# EAGLE design EEZ DIB PREL6 r1B3 (EAGLE 7.2.0)
Assembly variants: Farnell, TME

## Sheet 1 of 2: DIB interface
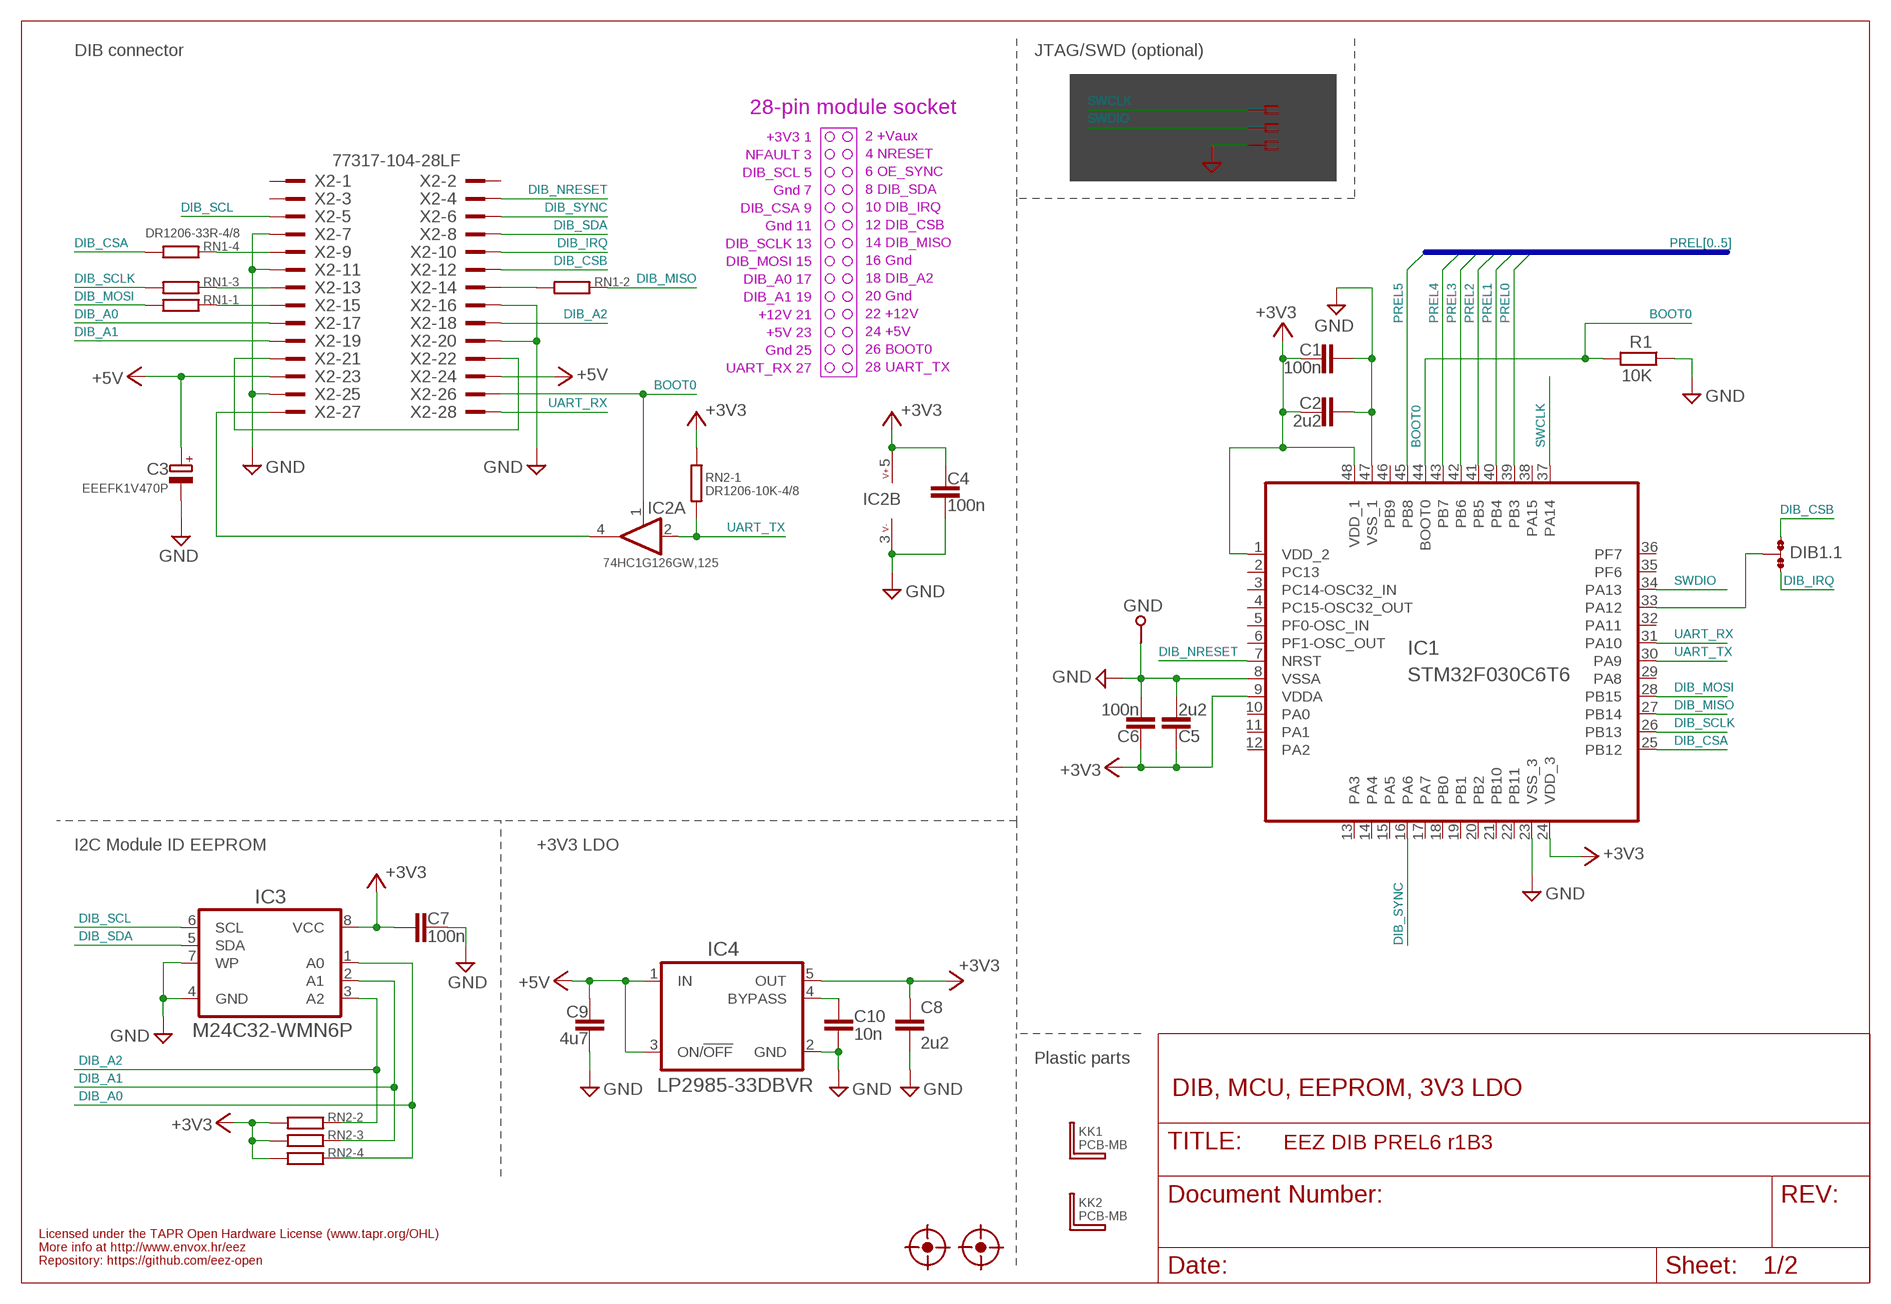
[diagram p0: schematic, sheet 1]

### Parts
C1  100n  C-EUC0603  [C0603]
C2  2u2  C-EUC0805  [C0805]
C3  EEEFK1V470P  ECAPPANASONIC_H  [CAPAE660X610N]
C4  100n  C-EUC0603  [C0603]
C5  2u2  C-EUC0805  [C0805]
C6  100n  C-EUC0603  [C0603]
C7  100n  C-EUC0603  [C0603]
C8  2u2  C-EUC0805  [C0805]
C9  4u7  C-EUC0805  [C0805]
C10  10n  C-EUC0805  [C0805]
DIB1.1  JP3-CUT-0805-ROTATED  [JP3-0805-CUT2]
FM1  FIDUCIAL_2  [FIDUCIAL_DUAL]
FM2  FIDUCIAL_2  [FIDUCIAL_DUAL]
GND  PCB_TEST_TABSHIELD  [PCB_SHIELD_TAB]
IC1  STM32F030C6T6  [LQFP-48]
IC2  74HC1G126GW,125  [SOT65P210X110-5N]
IC3  M24C32-WMN6P  AT24CXXSOIC8  [SOIC127P600X173-8N]
IC4  LP2985-33DBVR  LP2985  [SOT95P270X145-5N]
KK1  PCB-MB  [PCB-MB]
KK2  PCB-MB  [PCB-MB]
R1  10K  R-EU_R0805  [R0805]
RN1  DR1206-33R-4/8  R_ARRAY4  [CAY16]
RN2  DR1206-10K-4/8  R_ARRAY4  [CAY16]
X1  N.C.  SSW-106-02-S-S  [SSW-106-02-S-S]
X2  77317-104-28LF  [77317-104-28LF]

### Nets
+3V3: C1.2 C2.1 C4.1 C5.2 C6.1 C7.2 C8.1 IC1.1(VDD_2) IC1.9(VDDA) IC1.24(VDD_3) IC1.48(VDD_1) IC2.5(B:V+) IC3.8(VCC) IC4.5(OUT) RN2.5 RN2.6 RN2.7 RN2.8
+5V: C3.1(+) C9.2 IC4.1(IN) IC4.3(ON/!OFF) X2.23 X2.24 ; also sheet 2
BOOT0: IC1.44(BOOT0) IC2.1(A:EN) R1.2 X2.26
DIB_A0: IC3.1(A0) RN2.4 X2.17
DIB_A1: IC3.2(A1) RN2.3 X2.19
DIB_A2: IC3.3(A2) RN2.2 X2.18
DIB_CSA: IC1.25(PB12) RN1.4
DIB_CSB: DIB1.1.NO X2.12
DIB_IRQ: DIB1.1.NC X2.10
DIB_MISO: IC1.27(PB14) RN1.2
DIB_MOSI: IC1.28(PB15) RN1.1
DIB_NRESET: IC1.7(NRST) X2.4
DIB_SCL: IC3.6(SCL) X2.5
DIB_SCLK: IC1.26(PB13) RN1.3
DIB_SDA: IC3.5(SDA) X2.8
DIB_SYNC: IC1.16(PA6) X2.6
DIB_UART_RX: IC2.4(A:O) X2.27
GND: C1.1 C2.2 C3.2(-) C4.2 C5.1 C6.2 C7.1 C8.2 C9.1 C10.1 GND.1 IC1.8(VSSA) IC1.23(VSS_3) IC1.47(VSS_1) IC2.3(B:V-) IC3.4(GND) IC3.7(WP) IC4.2(GND) R1.1 X1.3 X2.7 X2.11 X2.16 X2.20 X2.25 ; also sheet 2
N$12: X2.21 X2.22
N$13: DIB1.1.COM IC1.33(PA12)
N$69: RN1.5 X2.9
N$70: C10.2 IC4.4(BYPASS)
N$99: RN1.6 X2.13
N$101: RN1.7 X2.14
N$102: RN1.8 X2.15
PREL0: IC1.39(PB3) ; also sheet 2
PREL1: IC1.40(PB4) ; also sheet 2
PREL2: IC1.41(PB5) ; also sheet 2
PREL3: IC1.42(PB6) ; also sheet 2
PREL4: IC1.43(PB7) ; also sheet 2
PREL5: IC1.45(PB8) ; also sheet 2
SWCLK: IC1.37(PA14) X1.2
SWDIO: IC1.34(PA13) X1.4
UART_RX: IC1.31(PA10) X2.28
UART_TX: IC1.30(PA9) IC2.2(A:I) RN2.1
Unconnected: IC1.2(PC13) IC1.3(PC14-OSC32_IN) IC1.4(PC15-OSC32_OUT) IC1.5(PF0-OSC_IN) IC1.6(PF1-OSC_OUT) IC1.10(PA0) IC1.11(PA1) IC1.12(PA2) IC1.13(PA3) IC1.14(PA4) IC1.15(PA5) IC1.17(PA7) IC1.18(PB0) IC1.19(PB1) IC1.20(PB2) IC1.21(PB10) IC1.22(PB11) IC1.29(PA8) IC1.32(PA11) IC1.35(PF6) IC1.36(PF7) IC1.38(PA15) IC1.46(PB9) X1.1 X1.5 X1.6 X2.1 X2.2 X2.3

### Buses
PREL[0..5]

### Notes on the sheet
- DIB connector | JTAG/SWD (optional)
- 28-pin module socket
- +3V3 1
- 2 +Vaux
- NFAULT 3
- 4 NRESET
- DIB_SCL 5
- 6 OE_SYNC
- Gnd 7
- 8 DIB_SDA
- DIB_CSA 9
- 10 DIB_IRQ
- Gnd 11
- 12 DIB_CSB
- DIB_SCLK 13
- 14 DIB_MISO
- DIB_MOSI 15
- 16 Gnd
- DIB_A0 17
- 18 DIB_A2
- DIB_A1 19
- 20 Gnd
- +12V 21
- 22 +12V
- +5V 23
- 24 +5V
- Gnd 25
- 26 BOOT0
- UART_RX 27
- 28 UART_TX
- I2C Module ID EEPROM | +3V3 LDO
- Plastic parts
- DIB, MCU, EEPROM, 3V3 LDO
- Licensed under the TAPR Open Hardware License (www.tapr.org/OHL)
- More info at http://www.envox.hr/eez
- Repository: https://github.com/eez-open

## Sheet 2 of 2
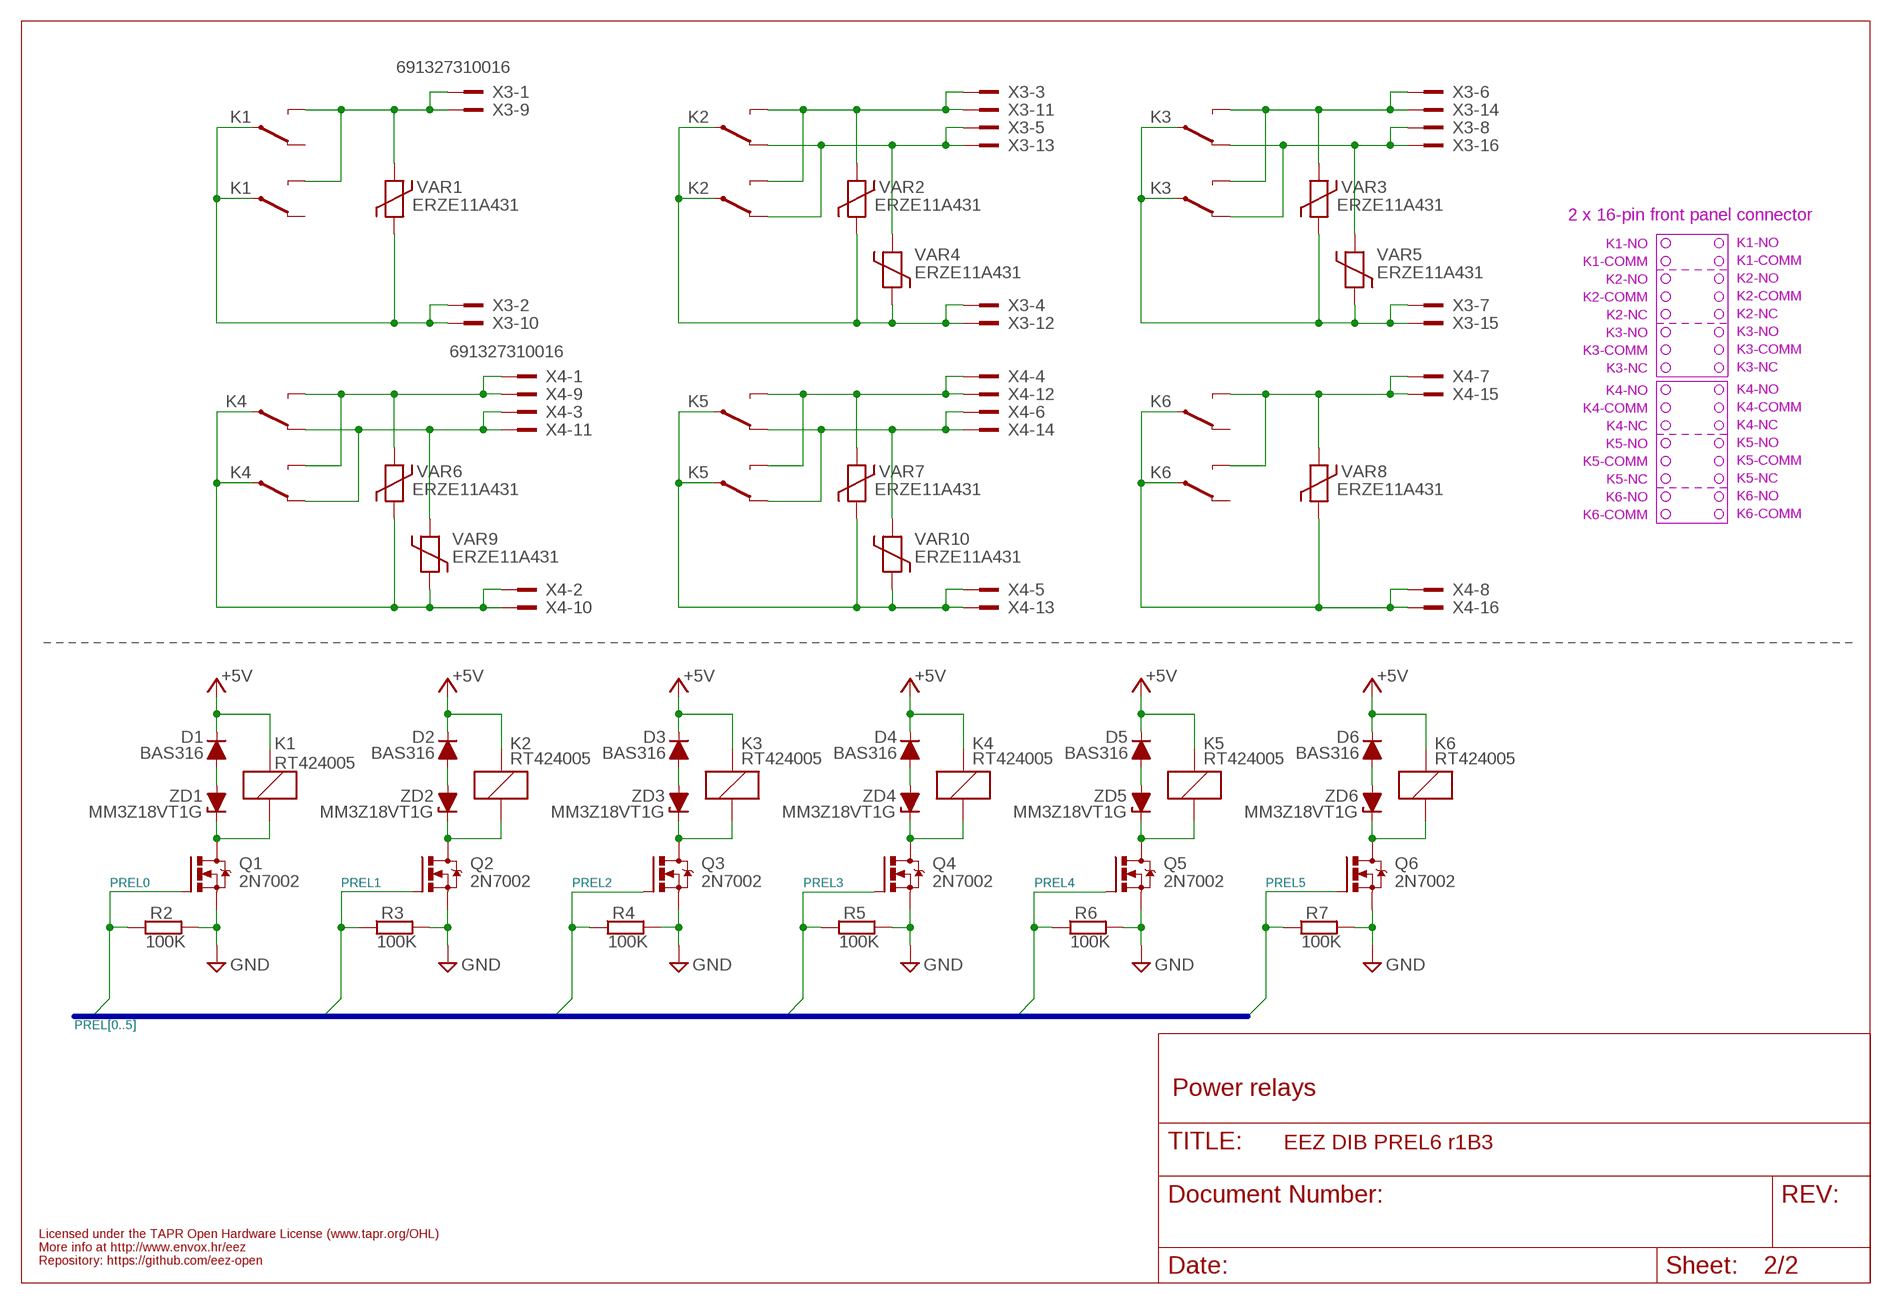
[diagram p1: schematic, sheet 2]

### Parts
D1  BAS316  DIODESOD323R  [SOD323-R]
D2  BAS316  DIODESOD323R  [SOD323-R]
D3  BAS316  DIODESOD323R  [SOD323-R]
D4  BAS316  DIODESOD323R  [SOD323-R]
D5  BAS316  DIODESOD323R  [SOD323-R]
D6  BAS316  DIODESOD323R  [SOD323-R]
K1  RT424005  RELAY_RT314012-2  [RT-C/016A5_ROUND]
K2  RT424005  RELAY_RT314012-2  [RT-C/016A5_ROUND]
K3  RT424005  RELAY_RT314012-2  [RT-C/016A5_ROUND]
K4  RT424005  RELAY_RT314012-2  [RT-C/016A5_ROUND]
K5  RT424005  RELAY_RT314012-2  [RT-C/016A5_ROUND]
K6  RT424005  RELAY_RT314012-2  [RT-C/016A5_ROUND]
Q1  2N7002  [SOT103P240X110-3N]
Q2  2N7002  [SOT103P240X110-3N]
Q3  2N7002  [SOT103P240X110-3N]
Q4  2N7002  [SOT103P240X110-3N]
Q5  2N7002  [SOT103P240X110-3N]
Q6  2N7002  [SOT103P240X110-3N]
R2  100K  R-EU_R0805  [R0805]
R3  100K  R-EU_R0805  [R0805]
R4  100K  R-EU_R0805  [R0805]
R5  100K  R-EU_R0805  [R0805]
R6  100K  R-EU_R0805  [R0805]
R7  100K  R-EU_R0805  [R0805]
VAR1  ERZE11A431  VARISTOR-13  [VARISTOR_13MM]
VAR2  ERZE11A431  VARISTOR-13  [VARISTOR_13MM]
VAR3  ERZE11A431  VARISTOR-13  [VARISTOR_13MM]
VAR4  ERZE11A431  VARISTOR-13  [VARISTOR_13MM]
VAR5  ERZE11A431  VARISTOR-13  [VARISTOR_13MM]
VAR6  ERZE11A431  VARISTOR-13  [VARISTOR_13MM]
VAR7  ERZE11A431  VARISTOR-13  [VARISTOR_13MM]
VAR8  ERZE11A431  VARISTOR-13  [VARISTOR_13MM]
VAR9  ERZE11A431  VARISTOR-13  [VARISTOR_13MM]
VAR10  ERZE11A431  VARISTOR-13  [VARISTOR_13MM]
X3  691327310016  [691327310016]
X4  691327310016  [691327310016]
ZD1  MM3Z18VT1G  ZENER-DIODESOD323R  [SOD323-R]
ZD2  MM3Z18VT1G  ZENER-DIODESOD323R  [SOD323-R]
ZD3  MM3Z18VT1G  ZENER-DIODESOD323R  [SOD323-R]
ZD4  MM3Z18VT1G  ZENER-DIODESOD323R  [SOD323-R]
ZD5  MM3Z18VT1G  ZENER-DIODESOD323R  [SOD323-R]
ZD6  MM3Z18VT1G  ZENER-DIODESOD323R  [SOD323-R]

### Nets
+5V: D1.C D2.C D3.C D4.C D5.C D6.C K1.A2(K:C1) K2.A2(K:C1) K3.A2(K:C1) K4.A2(K:C1) K5.A2(K:C1) K6.A2(K:C1) ; also sheet 1
GND: Q1.2(S) Q2.2(S) Q3.2(S) Q4.2(S) Q5.2(S) Q6.2(S) R2.2 R3.2 R4.2 R5.2 R6.2 R7.2 ; also sheet 1
N$1: D1.A ZD1.A
N$2: K1.A1(K:C2) Q1.3(D) ZD1.C
N$3: D2.A ZD2.A
N$4: K2.A1(K:C2) Q2.3(D) ZD2.C
N$6: D3.A ZD3.A
N$7: K3.A1(K:C2) Q3.3(D) ZD3.C
N$8: D4.A ZD4.A
N$9: K4.A1(K:C2) Q4.3(D) ZD4.C
N$10: D5.A ZD5.A
N$11: K5.A1(K:C2) Q5.3(D) ZD5.C
N$19: K4.12A(-1:S) K4.12B(-2:S) VAR9.2 X4.3 X4.11
N$21: K4.14A(-1:O) K4.14B(-2:O) VAR6.2 X4.1 X4.9
N$22: K5.12A(-1:S) K5.12B(-2:S) VAR10.2 X4.6 X4.14
N$23: K4.11A(-1:P) K4.11B(-2:P) VAR6.1 VAR9.1 X4.2 X4.10
N$24: K5.14A(-1:O) K5.14B(-2:O) VAR7.2 X4.4 X4.12
N$25: K1.14A(-1:O) K1.14B(-2:O) VAR1.2 X3.1 X3.9
N$26: K5.11A(-1:P) K5.11B(-2:P) VAR7.1 VAR10.1 X4.5 X4.13
N$27: K6.14A(-1:O) K6.14B(-2:O) VAR8.2 X4.7 X4.15
N$28: K1.11A(-1:P) K1.11B(-2:P) VAR1.1 X3.2 X3.10
N$29: K6.11A(-1:P) K6.11B(-2:P) VAR8.1 X4.8 X4.16
N$30: K2.14A(-1:O) K2.14B(-2:O) VAR2.2 X3.3 X3.11
N$31: K2.11A(-1:P) K2.11B(-2:P) VAR2.1 VAR4.1 X3.4 X3.12
N$32: K2.12A(-1:S) K2.12B(-2:S) VAR4.2 X3.5 X3.13
N$33: K3.14A(-1:O) K3.14B(-2:O) VAR3.2 X3.6 X3.14
N$34: K3.11A(-1:P) K3.11B(-2:P) VAR3.1 VAR5.1 X3.7 X3.15
N$35: K3.12A(-1:S) K3.12B(-2:S) VAR5.2 X3.8 X3.16
N$98: D6.A ZD6.A
N$100: K6.A1(K:C2) Q6.3(D) ZD6.C
PREL0: Q1.1(G) R2.1 ; also sheet 1
PREL1: Q2.1(G) R3.1 ; also sheet 1
PREL2: Q3.1(G) R4.1 ; also sheet 1
PREL3: Q4.1(G) R5.1 ; also sheet 1
PREL4: Q5.1(G) R6.1 ; also sheet 1
PREL5: Q6.1(G) R7.1 ; also sheet 1
Unconnected: K1.12A(-1:S) K1.12B(-2:S) K6.12A(-1:S) K6.12B(-2:S)

### Buses
PREL[0..5]

### Notes on the sheet
- 2 x 16-pin front panel connector
- K1-NO
- K1-NO
- K1-COMM
- K1-COMM
- K2-NO
- K2-NO
- K2-COMM
- K2-COMM
- K2-NC
- K2-NC
- K3-NO
- K3-NO
- K3-COMM
- K3-COMM
- K3-NC
- K3-NC
- K4-NO
- K4-NO
- K4-COMM
- K4-COMM
- K4-NC
- K4-NC
- K5-NO
- K5-NO
- K5-COMM
- K5-COMM
- K5-NC
- K5-NC
- K6-NO
- K6-NO
- K6-COMM
- K6-COMM
- Power relays
- Licensed under the TAPR Open Hardware License (www.tapr.org/OHL)
- More info at http://www.envox.hr/eez
- Repository: https://github.com/eez-open

## Library data of the parts
C1 C2 C4-C10 = rcl:C-EU: CAPACITOR, European symbol
C3 = EEZ_Lib1:ECAP
D1-D6 = EEZ_Lib1:DIODE
DIB1.1 = EEZ_Lib1:JP3-CUT
FM1 FM2 = EEZ_Lib1:FIDUCIAL: Fiducial mark for pick and place automation
GND = EEZ_Lib1:PCB_TEST_TAB
IC1 = EEZ_DIB:STM32F030: Arm® 32-bit Cortex®-M0 CPU
IC2 = EEZ_Lib1:74HC1G126: Single Bus Buffer Gate With 3-State Outputs
IC3 = EEZ_Lib1:AT24CXX: I2C-Compatible (2-wire) Serial EEPROM
IC4 = EEZ_DIB:LP2985: 150-mA Low-noise Low-dropout Regulator With Shutdown
K1-K6 = EEZ_Lib1:RELAY_RT314012
KK1 KK2 = EEZ_Lib1:PCB-MB: Richo Mounting Block; 16 x 6 mm
Q1-Q6 = EEZ_Lib1:2N7002: N-CHANNEL ENHANCEMENT MODE FIELD EFFECT TRANSISTOR; MPN: 2N7002-7-F; OC_FARNELL: 1713823; OC_NEWARK: 25R5679; PACKAGE: SOT-23-3; SUPPLIER: DIODES INC.
R1-R7 = rcl:R-EU_: RESISTOR, European symbol
RN1 RN2 = EEZ_Lib1:R_ARRAY4: 1206 four resistor array
VAR1-VAR10 = EEZ_Lib1:VARISTOR: EPCOS - B72220S0251K101 - VARISTOR, 140J, 250VAC Farnell: 1004357
X1 = con-samtec:SSW-106-02-S-S: THROUGH-HOLE .025" SQ POST SOCKET Source: Samtec SSW.pdf; MPN: SSW-106-02-S-S; OC_FARNELL: unknown; OC_NEWARK: 11P9416
X2 = EEZ_connectors:77317-104-28LF: Headers & Wire Housings 28P right angle 0.1" pitch
X3 X4 = EEZ_connectors:691327310016: WR-TBL Serie 3273 – 3.81mm Close Horizontal Dual Row PCB Header, 16 Pins
ZD1-ZD6 = EEZ_Lib1:ZENER-DIODE

## Net classes
0 default: width 0.203 mm, drill 0.3 mm, clearance 0.203 mm
1 lvds: width 0.152 mm, drill 0.3 mm, clearance 0.152 mm to class 0, clearance 0.152 mm
2 gnd: width 0.254 mm, drill 0.584 mm, clearance 0.254 mm
3 diff_in: width 0.254 mm, drill 0.584 mm, clearance 0.203 mm to class 0, clearance 0.203 mm to class 1, clearance 0.203 mm to class 2, clearance 0.203 mm

## Board
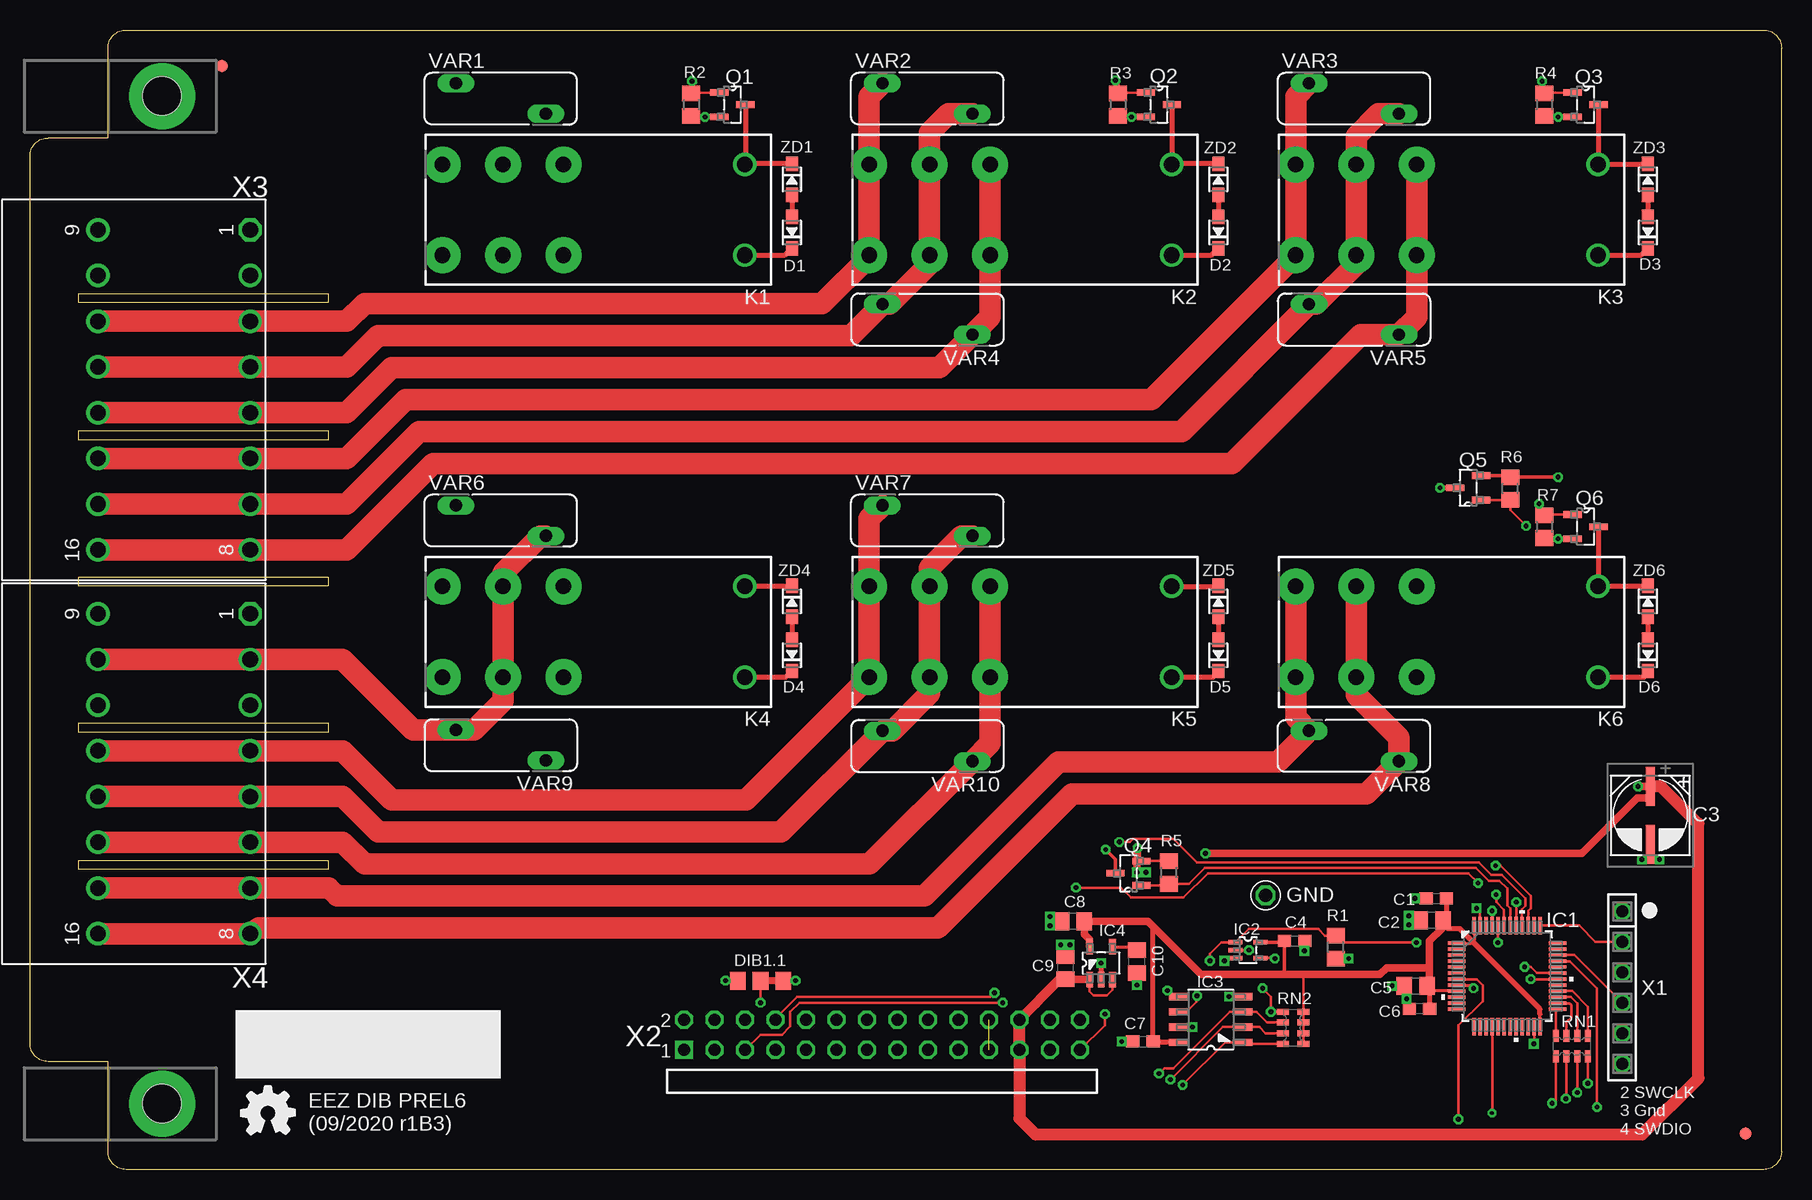
[diagram p2: board, top side]
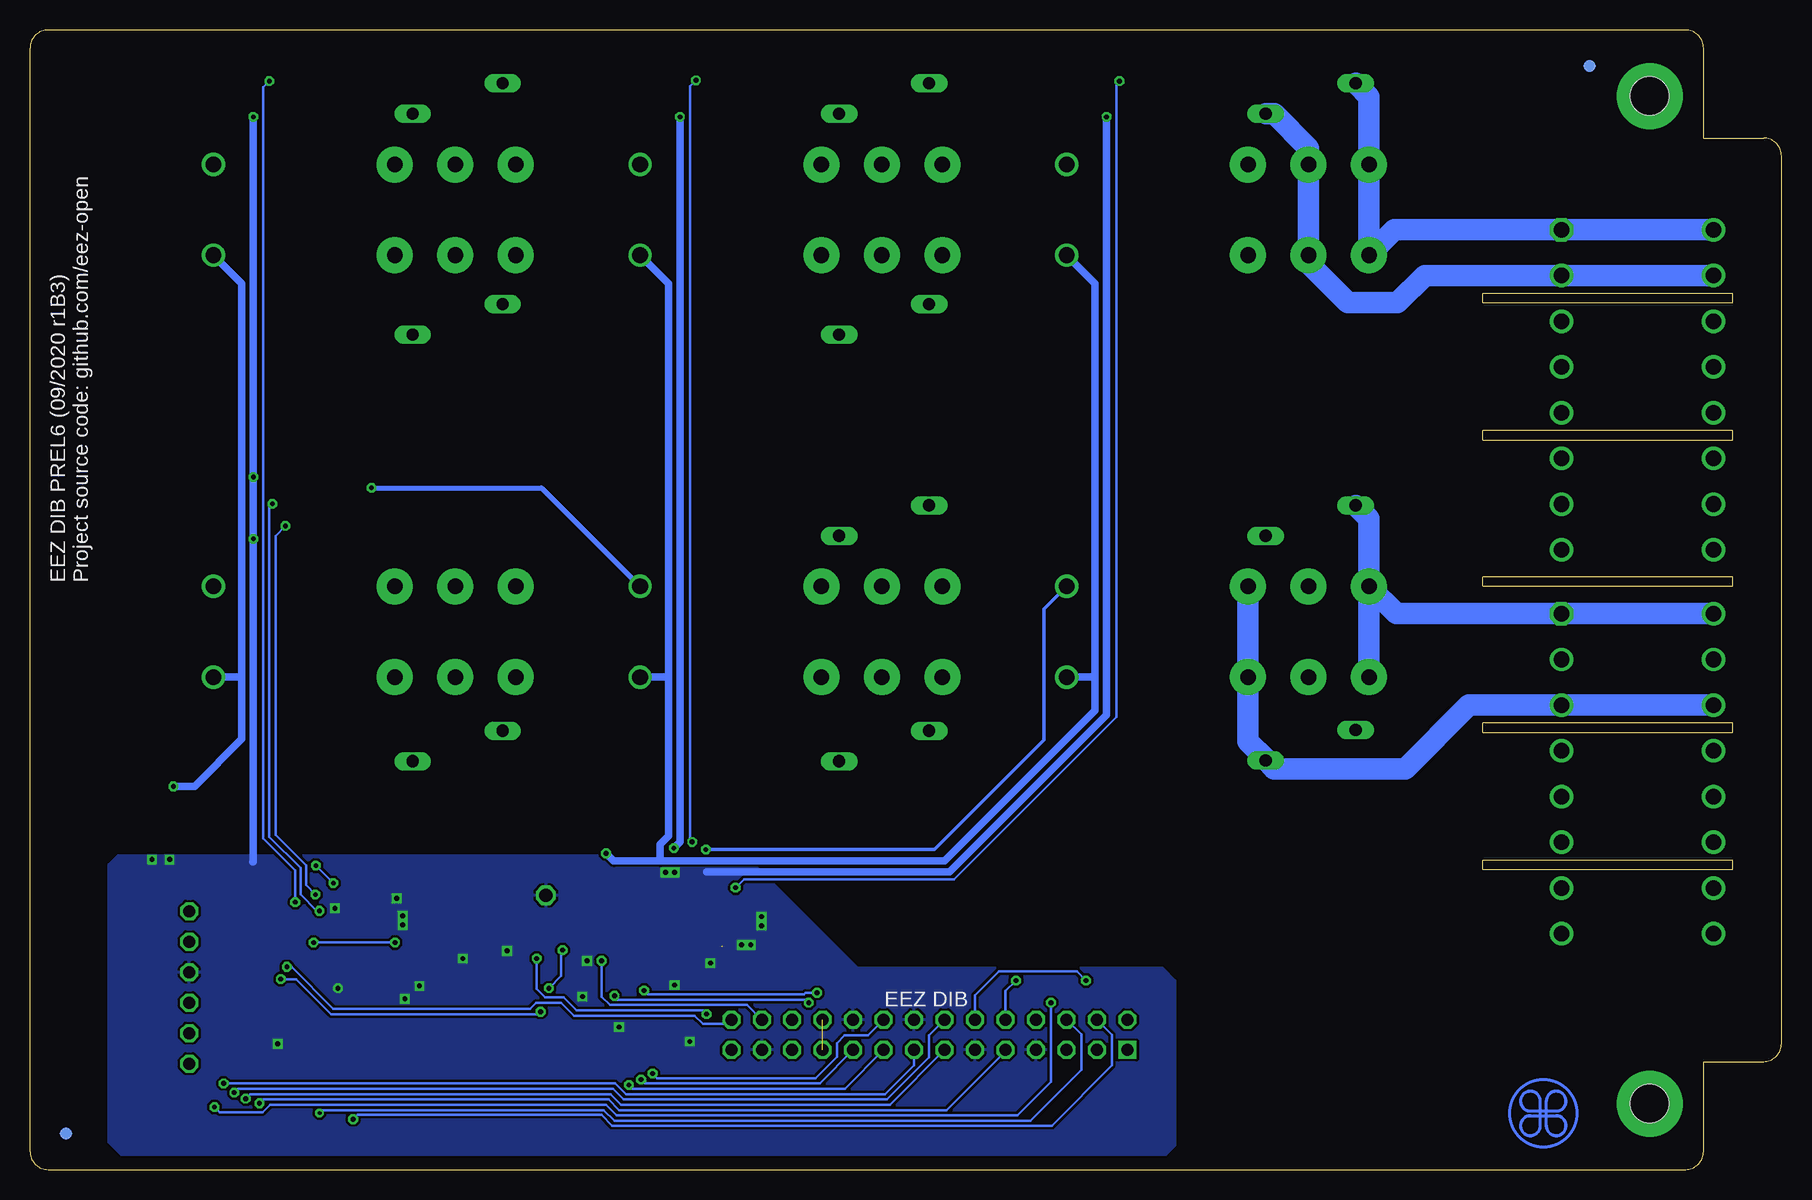
[diagram p3: board, bottom side, seen from below]

Size 146 x 95 mm. Coordinates in mm from the lower left corner, seen from the top.
Outline: 8,95 144.5,95 arc-90 146,93.5 146,1.5 arc-90 144.5,0 8,0 arc-90 6.5,1.5 6.5,9 1.5,9 arc-90 0,10.5 0,84.5 arc-90 1.5,86 6.5,86 6.5,93.5 arc-90 8,95
Outline: 4.06,25.78 24.89,25.78 24.89,25.02 4.06,25.02 4.06,25.78
Outline: 4.06,37.21 24.89,37.21 24.89,36.45 4.06,36.45 4.06,37.21
Outline: 4.06,49.4 24.89,49.4 24.89,48.64 4.06,48.64 4.06,49.4
Outline: 4.06,61.59 24.89,61.59 24.89,60.83 4.06,60.83 4.06,61.59
Outline: 4.06,73.03 24.89,73.03 24.89,72.26 4.06,72.26 4.06,73.03
Copper layers (1*16): Top 0.035mm / dielectric 1.5mm / Bottom 0.035mm
Design rules "default *": minimum track width 6mil, minimum drill 0.3mm, track to track 6mil, track to pad 6mil, pad to pad 6mil, via to via 6mil, smd to smd 6mil, copper to edge 40mil, drill to drill 8mil, minimum pad ring 4mil, minimum via ring 8mil, stop-mask expansion 2.5mil, vias tented up to drill 1mm, thermal gap 8mil
vRestrict: area 0,0 to 42,14; area 53,0 to 128,8.5

### Footprints (pad centres in the part's own frame; a part is rotated, then mirrored left to right if it is on the bottom)
C0603 = smd 1.1 x 1: 1 -0.85,0; 2 0.85,0
C0805 = smd 1.3 x 1.5: 1 -0.95,0; 2 0.95,0
CAPAE660X610N = smd 3.251 x 0.762: 1 -2.413,0; 2 2.413,0
SOD323-R = smd 1.2 x 1: A 1.3,0; C -1.3,0
JP3-0805-CUT2 = smd 1.3 x 1.5: COM 0,0; NC 1.9,0; NO -1.9,0
FIDUCIAL_DUAL = smd 1.016 x 1.016 bottom: B 0,0 | smd 1.016 x 1.016: T 0,0
PCB_SHIELD_TAB = drill 1.1 octagon: 1 0,0
LQFP-48 = smd 1.473 x 0.279: 1 -4.216,2.743; 2 -4.216,2.261; 3 -4.216,1.753; 4 -4.216,1.245; 5 -4.216,0.762; 6 -4.216,0.254; 7 -4.216,-0.254; 8 -4.216,-0.762; 9 -4.216,-1.245; 10 -4.216,-1.753; 11 -4.216,-2.261; 12 -4.216,-2.743; 25 4.216,-2.743; 26 4.216,-2.261; 27 4.216,-1.753; 28 4.216,-1.245; 29 4.216,-0.762; 30 4.216,-0.254; 31 4.216,0.254; 32 4.216,0.762; 33 4.216,1.245; 34 4.216,1.753; 35 4.216,2.261; 36 4.216,2.743 | smd 0.279 x 1.473: 13 -2.743,-4.216; 14 -2.261,-4.216; 15 -1.753,-4.216; 16 -1.245,-4.216; 17 -0.762,-4.216; 18 -0.254,-4.216; 19 0.254,-4.216; 20 0.762,-4.216; 21 1.245,-4.216; 22 1.753,-4.216; 23 2.261,-4.216; 24 2.743,-4.216; 37 2.743,4.216; 38 2.261,4.216; 39 1.753,4.216; 40 1.245,4.216; 41 0.762,4.216; 42 0.254,4.216; 43 -0.254,4.216; 44 -0.762,4.216; 45 -1.245,4.216; 46 -1.753,4.216; 47 -2.261,4.216; 48 -2.743,4.216
SOT65P210X110-5N = smd 1.168 x 0.356: 1 -1.041,0.66; 2 -1.041,0; 3 -1.041,-0.66; 4 1.041,-0.66; 5 1.041,0.66
SOIC127P600X173-8N = smd 1.55 x 0.6: 1 -2.7,1.9; 2 -2.7,0.63; 3 -2.7,-0.64; 4 -2.7,-1.91; 5 2.7,-1.91; 6 2.7,-0.64; 7 2.7,0.63; 8 2.7,1.9
SOT95P270X145-5N = smd 1.321 x 0.559: 1 -1.372,0.94; 2 -1.372,0; 3 -1.372,-0.94; 4 1.372,-0.94; 5 1.372,0.94
RT-C/016A5_ROUND = drill 1.3 pad 3: 11A 8.83,3.78; 11B 8.83,-3.78; 12A 3.79,3.78; 12B 3.79,-3.78; 14A 13.87,3.78; 14B 13.87,-3.78 | drill 1.3: A1 -11.33,-3.78; A2 -11.33,3.78
PCB-MB = hole 3.2: 0,0
SOT103P240X110-3N = smd 1.524 x 0.559: 1 -1.079,1.016; 2 -1.079,-1.016; 3 1.079,0
R0805 = smd 1.3 x 1.5: 1 -0.95,0; 2 0.95,0
CAY16 = smd 0.5 x 1: 1 -1.35,-0.85; 2 -0.45,-0.85; 3 0.45,-0.85; 4 1.35,-0.85; 5 1.35,0.85; 6 0.45,0.85; 7 -0.45,0.85; 8 -1.35,0.85
VARISTOR_13MM = drill 1.016 long: 1 3.75,-1.27; 2 -3.75,1.27
SSW-106-02-S-S = drill 1 pad 1.5 octagon: 1 -6.35,0; 2 -3.81,0; 3 -1.27,0; 4 1.27,0; 5 3.81,0; 6 6.35,0
77317-104-28LF = drill 1 pad 1.5 square: 1 -33.02,-2.54 | drill 1 pad 1.5 octagon: 2 -33.02,0; 3 -30.48,-2.54; 4 -30.48,0; 5 -27.94,-2.54; 6 -27.94,0; 7 -25.4,-2.54; 8 -25.4,0; 9 -22.86,-2.54; 10 -22.86,0; 11 -20.32,-2.54; 12 -20.32,0; 13 -17.78,-2.54; 14 -17.78,0; 15 -15.24,-2.54; 16 -15.24,0; 17 -12.7,-2.54; 18 -12.7,0; 19 -10.16,-2.54; 20 -10.16,0; 21 -7.62,-2.54; 22 -7.62,0; 23 -5.08,-2.54; 24 -5.08,0; 25 -2.54,-2.54; 26 -2.54,0; 27 0,-2.54; 28 0,0
691327310016 = drill 1.3 octagon: 1 -13.335,6.35 | drill 1.3: 2 -9.525,6.35; 3 -5.715,6.35; 4 -1.905,6.35; 5 1.905,6.35; 6 5.715,6.35; 7 9.525,6.35; 8 13.335,6.35; 9 -13.335,-6.35; 10 -9.525,-6.35; 11 -5.715,-6.35; 12 -1.905,-6.35; 13 1.905,-6.35; 14 5.715,-6.35; 15 9.525,-6.35; 16 13.335,-6.35

### Placement (x,y rotation side)
C1  117.22,22.61 0 top
C2  116.84,20.76 180 top
C3  135.06,29.53 270 top
C4  105.41,19.05 0 top
C5  115.51,15.3 0 top
C6  115.82,13.4 180 top
C7  92.77,10.67 0 top
C8  86.93,20.7 180 top
C9  86.3,16.83 270 top
C10  92.27,17.34 90 top
D1  63.5,78.11 90 top
D2  99.06,78.11 90 top
D3  134.87,78.11 90 top
D4  63.5,42.86 90 top
D5  99.06,42.86 90 top
D6  134.87,42.86 90 top
DIB1.1  60.9,15.75 0 top
EEZ_SIGNATURE  SIGNATURESMALL  [SIGNATURE_5MM]  19.86,4.68 180 top
FM1  16,92 0 top
FM2  143,3 0 top
GND  103,22.86 0 top
IC1  123.13,16.13 0 top
IC2  101.54,18.29 0 top
IC3  98.42,12.51 180 top
IC4  89.28,17.21 90 top
K1  48.26,80.01 180 top
K2  83.82,80.01 180 top
K3  119.38,80.01 180 top
K4  48.26,44.83 180 top
K5  83.82,44.83 180 top
K6  119.38,44.83 180 top
KK1  11,89.5 0 top
KK2  11,5.5 0 top
Q1  58.55,88.77 0 top
Q2  94.11,88.77 0 top
Q3  129.67,88.77 0 top
Q4  91.57,24.7 180 top
Q5  119.89,56.83 180 top
Q6  129.67,53.59 0 top
R1  108.84,18.54 90 top
R2  55.12,88.77 270 top
R3  90.68,88.77 270 top
R4  126.24,88.77 270 top
R5  94.93,24.77 90 top
R6  123.38,56.77 90 top
R7  126.24,53.59 270 top
RN1  128.52,10.29 180 top
RN2  105.28,11.81 270 top
VAR1  39.24,89.28 0 top
VAR2  74.8,89.28 0 top
VAR3  110.36,89.28 0 top
VAR4  74.8,70.87 180 top
VAR5  110.36,70.87 180 top
VAR6  39.24,54.1 0 top
VAR7  74.8,54.1 0 top
VAR8  110.36,35.31 0 top
VAR9  39.24,35.37 180 top
VAR10  74.8,35.31 180 top
X1  132.72,15.18 270 top
X2  87.54,12.5 0 top
X3  12,65 270 top
X4  12,33 270 top
ZD1  63.5,82.55 270 top
ZD2  99.06,82.55 270 top
ZD3  134.87,82.55 270 top
ZD4  63.5,47.37 270 top
ZD5  99.06,47.37 270 top
ZD6  134.87,47.37 270 top

### Tracks (layer width: path | path; a pad name or v marks a point on that pad's centre or on a via)
+3V3  (1 unrouted)
  Top 0.203: RN2.5 RN2.6 RN2.7 RN2.8 106.13,16.17 105.79,16.26
  Top 0.254: IC1.24 125.87,12.94 | IC1.48 120.38,19.1 120.27,18.99 120.16,18.87 IC1.1 | IC1.9 116.85,14.88 116.67,14.71
  Top 0.305: 104.52,16.26 104.56,16.3 C4.1 104.46,18.95 IC2.5 | 103.15,16.23 103.12,16.26 | 107.31,16.32 107.25,16.26
  Top 0.406: 125.87,12.94 125.87,13.39 120.27,18.99 119.19,20.07 118.18,20.07 C2.1 118.07,21.05 C1.2 | IC3.8 93.68,10.61 C7.2 93.62,20.23 93.19,20.67 | C6.1 116.67,14.71 C5.2
  Top 0.61: C2.1 117.67,20.07 116.65,19.05 116.65,16.89 | 116.65,16.89 116.65,14.99 C5.2 | 116.65,16.89 116.59,16.83 113.09,16.83 112.52,16.26 107.25,16.26 105.79,16.26 104.52,16.26 103.12,16.26 97.6,16.26 93.19,20.67 87.91,20.67 | 87.91,20.67 C8.1 | 87.91,20.67 87.91,19.59 88.33,19.18 88.33,18.59
+5V  (via drill 0.4)
  Top 0.203: IC4.3 90.22,14.97 89.79,14.54 88.65,14.54 88.33,14.86 88.33,15.82 IC4.1
  Top 0.254: IC4.1 88.31,15.87
  Top 0.406: K1.A2 62.92,76.23 D1.C | K4.A2 62.99,41.05 D4.C | K2.A2 98.48,76.23 D2.C | K5.A2 98.61,41.05 D5.C | K6.A2 134.55,41.05 D6.C | K3.A2 134.3,76.23 D3.C
  Top 0.61: v134.05,31.94 C3.1 135.06,30.99 133.99,30.99 129.35,26.35 v97.98,26.35 | 88.31,15.87 C9.2
  Top 0.813: X2.24 85.83,15.87 C9.2
  Top 1.016: X2.24 X2.23 82.46,4.28 83.82,2.92 134.37,2.92 139.06,7.62 139.06,28.83 135.95,31.94 C3.1
  Bottom 0.61: 92.77,41.02 92.77,73.85 K2.A2 | K5.A2 92.8,41.05 92.77,41.02 | K1.A2 57.21,73.85 57.21,41.05 | 57.21,41.05 57.21,38.29 69.79,25.72 93.47,25.72 | K4.A2 57.21,41.05 | 128.33,40.96 128.33,73.85 K3.A2 | 128.33,40.96 128.33,35.88 132.27,31.94 v134.05,31.94 | 92.77,41.02 92.77,27.81 93.47,27.11 93.47,25.72 | K6.A2 128.43,41.05 128.33,40.96 | 93.47,25.72 97.35,25.72 v97.98,26.35
BOOT0  (via drill 0.4)
  Top 0.203: IC1.44 v122.36,18.92 | 109.15,19.18 R1.2 | R1.2 107.95,19.49 107.38,20.07 101.61,20.07 IC2.1 100.47,18.92 99.31,18.92 98.36,17.97 v98.36,17.4 | v115.57,18.92 109.41,18.92 R1.2
  Bottom 0.203: v122.36,18.92 v115.57,18.92 | X2.26 85.02,12.5 86.23,13.72 97.66,13.72 98.36,14.41 v98.36,17.4
DIB_A0  (via drill 0.4)
  Top 0.203: RN2.4 101.27,10.46 IC3.1 99.64,10.61 v96.08,7.05
  Bottom 0.203: X2.17 78.07,6.73 95.76,6.73 v96.08,7.05
DIB_A1  (via drill 0.4)
  Top 0.203: RN2.3 103,11.37 102.48,11.88 IC3.2 99.45,11.88 v95.06,7.49
  Bottom 0.203: X2.19 80.17,7.18 94.74,7.18 v95.06,7.49
DIB_A2  (via drill 0.4)
  Top 0.203: RN2.2 103.12,12.26 102.23,13.15 IC3.3 100.02,13.15 95.31,8.45 94.55,8.45 v94.11,8
  Bottom 0.203: X2.18 76.16,11.18 78.11,11.18 78.74,10.54 78.74,9.4 80.52,7.62 93.73,7.62 v94.11,8
DIB_CSA
  Top 0.203: RN1.4 127.17,13.32 IC1.25
DIB_CSB  (via drill 0.4)
  Top 0.203: v57.98,15.75 DIB1.1.NO
  Bottom 0.203: X2.12 67.22,14.51 65.22,16.51 58.74,16.51 v57.98,15.75
DIB_IRQ  (via drill 0.4)
  Top 0.203: DIB1.1.NC v63.82,15.75
  Bottom 0.203: X2.10 64.68,14.89 v63.82,15.75
DIB_MISO
  Top 0.203: RN1.2 128.97,13.84 128.44,14.38 IC1.27
DIB_MOSI
  Top 0.203: RN1.1 129.87,13.57 128.56,14.88 IC1.28
DIB_NRESET  (via drill 0.4)
  Top 0.203: IC1.7 120.59,15.88 121.09,15.37 121.09,14.03 119.06,12 v119.06,4.19
  Bottom 0.203: v119.06,4.19 118.71,4.55 98.35,4.55 97.46,3.66 60.82,3.66 55.8,8.67 55.8,11.24 X2.4
DIB_SCL  (via drill 0.4)
  Top 0.203: X2.5 59.62,9.96 60.9,11.24 62.67,11.24 63.37,11.94 63.37,13.14 64.14,13.91 v81.09,13.91 | IC3.6 96.4,13.15 97.22,13.97 97.22,14.41 v97.28,14.48
  Bottom 0.203: v97.28,14.48 97.03,14.16 81.34,14.16 v81.09,13.91
DIB_SCLK
  Top 0.203: RN1.3 128.07,12.31 128.46,12.7 128.46,13.72 128.31,13.87 IC1.26
DIB_SDA  (via drill 0.4)
  Top 0.203: X2.8 62.14,12.61 63.94,14.41 80.07,14.41 v80.39,14.73 | IC3.5 95.31,14.42 v94.81,14.92
  Bottom 0.203: v94.81,14.92 94.49,14.61 81.47,14.61 81.34,14.73 v80.39,14.73
DIB_SYNC  (via drill 0.3)
  Top 0.203: v121.86,4.7 121.88,4.66 IC1.16
  Bottom 0.203: X2.6 58.36,11.26 58.36,8.32 62.61,4.06 97.28,4.06 98.17,4.95 121.6,4.95 v121.86,4.7
DIB_UART_RX  (via drill 0.4)
  Top 0.203: IC2.4 103.72,17.63 v103.76,17.59 | v89.6,12.95 89.6,12.02 X2.27
  Bottom 0.203: v103.76,17.59 103.76,15.05 103.06,14.35 101.54,14.35 100.46,13.27 89.92,13.27 v89.6,12.95
GND  (via drill 0.4)
  Top 0.203: IC1.47 120.87,21.5 v120.59,21.78 | C2.2 115.63,20.57 v114.94,20.38 | C4.2 v106.24,18.22 | IC3.4 v99.95,14.42 v99.95,14.41 | IC1.23 125.39,10.45 v125.35,10.48 | R1.1 v109.92,17.59 | Q4.2 92.39,25.72 92.33,25.78 | 92.27,25.65 92.58,25.65 Q4.2 | R5.2 Q4.2 | IC2.3 99.8,17.63 v99.57,17.4
  Top 0.254: C5.1 v113.54,15.3 | C6.2 v114.75,14.22 | IC1.8 120.08,15.37 v120.33,15.11
  Top 0.305: Q5.2 123.25,57.85 R6.2 v127.38,57.72 | v134.37,25.84 135.06,25.84 C3.2
  Top 0.406: v89.28,17.21 IC4.2 | C10.1 v92.27,15.37 | C7.1 v91,10.67 | IC3.7 v96.9,11.88 v96.9,11.87 | Q1.2 v56.26,87.76 56.2,87.82 R2.2 | Q3.2 v127.38,87.76 127.31,87.82 R4.2 | Q2.2 v91.82,87.76 91.75,87.82 R3.2 | Q6.2 v127.38,52.58 127.31,52.64 R7.2 | C1.1 v115.44,22.61
  Top 0.61: C8.2 v85.03,21.08 | v92.33,26.8 92.33,25.78 | v92.27,24.77 92.27,25.65 | v85.92,18.73 85.92,18.16 C9.1
  Bottom 0.61: 89.6,24.83 69.34,24.83 56.26,37.91 v56.26,87.76 | v91.82,87.76 91.82,27.3 v92.33,26.8 | 127.38,25.65 127.44,25.65 127.38,25.72 v127.38,52.58 v127.38,57.72 v127.38,87.76
  other vias: 86.68,18.73 135.83,25.84 114.94,21.15 93.03,24.77 85.03,20.32
  pour Bottom: 51.56,16.76 76.96,16.76 86.36,26.16 138.68,26.16 139.45,25.4 139.45,2.29 138.43,1.27 51.31,1.27 50.55,2.03 50.55,15.75
HOLE_DL  (via drill 3.2 pad 5.5)
  other vias: 11,5.5
HOLE_UL  (via drill 3.2 pad 5.5)
  other vias: 11,89.5
N$1
  Top 0.406: ZD1.A D1.A
N$2
  Top 0.406: Q1.3 59.63,83.83 K1.A1 59.65,83.85 ZD1.C
N$3
  Top 0.406: ZD2.A D2.A
N$4
  Top 0.406: Q2.3 95.19,83.83 K2.A1 95.21,83.85 ZD2.C
N$6
  Top 0.406: ZD3.A D3.A
N$7
  Top 0.406: Q3.3 130.75,83.83 | 130.75,83.83 K3.A1 | 130.75,83.83 134.85,83.83 ZD3.C
N$8
  Top 0.406: ZD4.A D4.A
N$9  (via drill 0.4)
  Top 0.305: Q4.3 90.49,25.84 v89.66,26.67
  Top 0.406: K4.A1 59.63,48.65 63.48,48.65 ZD4.C
  Bottom 0.305: v89.66,26.67 70.61,26.67 61.47,35.81 61.47,46.73 K4.A1
N$10
  Top 0.406: ZD5.A D5.A
N$11  (via drill 0.4)
  Top 0.406: K5.A1 98.75,48.61 ZD5.C | Q5.3 v117.54,56.83
  Bottom 0.406: v117.54,56.83 103.37,56.83 K5.A1
N$12  (1 unrouted)
N$13  (via drill 0.4)
  Top 0.203: IC1.33 128.36,17.37 130.62,15.11 v130.62,5.21 | DIB1.1.COM v60.9,13.91
  Bottom 0.203: v130.62,5.21 130.18,4.76 126.62,4.76 125.98,5.4 97.98,5.4 97.09,4.51 63.69,4.51 60.9,7.3 v60.9,13.91
N$19
  Bottom 1.778: K4.12B K4.12A 44.47,35.71 42.99,34.23 VAR9.2 42.29,33.4 31.37,33.4 26.05,38.72 X4.3 X4.11
N$21
  Bottom 1.778: K4.14B K4.14A | K4.14B 34.39,54.27 VAR6.2 | X4.9 X4.1 32.11,46.34 K4.14B
N$22
  Top 1.778: K5.12B K5.12A 80.03,35.51 VAR10.2 69.98,25.46 27.88,25.46 26.05,27.29 X4.6 X4.14
N$23
  Top 1.778: VAR6.1 42.55,52.83 39.43,49.72 K4.11B K4.11A 39.43,39.05 37.02,36.64 VAR9.1 31.94,36.64 26.05,42.52 X4.2 X4.10
N$24
  Top 1.778: VAR7.2 69.95,54.27 K5.14B K5.14A 59.69,30.8 30.16,30.8 26.05,34.91 X4.4 X4.12
N$25
  Bottom 1.778: VAR1.2 34.39,89.45 K1.14B K1.14A 32.28,78.33 X3.1 X3.9
N$26
  Top 1.778: 26.05,31.09 29.02,28.13 62.61,28.13 VAR10.1 71.88,36.58 74.99,39.68 K5.11A K5.11B 74.99,50.16 77.66,52.83 VAR7.1 | 26.05,31.09 26.04,31.11 | 26.05,31.09 X4.5 X4.13
N$27
  Top 1.778: K6.14B K6.14A 105.51,37.68 VAR8.2 104.01,33.97 85.72,33.97 74.55,22.8 25.59,22.8 24.91,23.48 X4.7 X4.15
N$28
  Bottom 1.778: X3.10 X3.2 29.74,74.53 32,72.26 36.13,72.26 39.43,75.56 K1.11A K1.11B 39.43,85.15 42.29,88.01 VAR1.1
N$29
  Top 1.778: K6.11B K6.11A 110.55,39.56 114.11,36 VAR8.1 111.38,31.3 86.87,31.3 75.69,20.13 19.06,20.13 X4.8 X4.16
N$30
  Top 1.778: X3.11 X3.3 26.39,70.72 27.88,72.2 66.04,72.2 69.95,76.05 K2.14A K2.14B 69.95,89.45 VAR2.2
N$31
  Top 1.778: X3.12 X3.4 26.39,66.91 29.02,69.53 68.45,69.53 VAR4.1 71.63,72.14 74.99,75.5 K2.11A K2.11B 74.99,86.42 76.58,88.01 VAR2.1
N$32
  Top 1.778: X3.13 X3.5 26.39,63.09 30.16,66.86 75.82,66.86 VAR4.2 80.03,71.07 K2.12A K2.12B
N$33
  Top 1.778: VAR3.2 105.51,89.45 K3.14B K3.14A 93.48,64.2 31.3,64.2 26.39,59.28 X3.6 X3.14
N$34
  Top 1.778: VAR3.1 112.39,88.01 110.55,86.17 K3.11B K3.11A 110.55,75.5 107.19,72.14 VAR5.1 96.01,61.53 32.45,61.53 26.39,55.48 X3.7 X3.15
N$35
  Top 1.778: X3.16 X3.8 26.39,51.66 33.59,58.86 100.2,58.86 110.93,69.6 VAR5.2 115.59,71.07 K3.12A K3.12B
N$69  (via drill 0.4)
  Top 0.203: RN1.5 127.17,5.83 v126.87,5.52
  Bottom 0.203: v126.87,5.52 126.56,5.84 97.79,5.84 96.9,4.95 69.6,4.95 64.68,9.87 X2.9
N$70
  Top 0.254: IC4.4 91.97,18.58 C10.2
N$98
  Top 0.406: ZD6.A D6.A
N$99  (via drill 0.4)
  Top 0.203: RN1.6 128.07,5.96 v128.02,5.91
  Bottom 0.203: v128.02,5.91 127.64,6.29 97.6,6.29 96.71,5.4 74.32,5.4 X2.13
N$100
  Top 0.406: Q6.3 130.75,48.65 | 130.75,48.65 K6.A1 | 130.75,48.65 134.85,48.65 ZD6.C
N$101  (via drill 0.4)
  Top 0.203: RN1.7 v128.97,6.42 v128.97,6.41
  Bottom 0.203: X2.14 71.06,11.2 71.06,9.34 74.55,5.84 96.52,5.84 97.41,6.73 128.65,6.73 v128.97,6.41
N$102  (via drill 0.4)
  Top 0.203: RN1.8 129.87,7.19 v129.86,7.18
  Bottom 0.203: v129.86,7.18 97.22,7.18 96.33,6.29 74.74,6.29 72.33,8.7 72.33,9.93 X2.15
PREL0  (via drill 0.4)
  Top 0.203: 55.18,89.79 55.18,90.61 v55.18,90.74 | Q1.1 55.18,89.79 | 55.18,89.79 R2.1 | IC1.39 124.88,21.57 125.09,21.78 125.09,22.8 122.56,25.34 v122.17,25.34 | v87.19,23.5 90.93,23.5 91.76,22.67 96.14,22.67 98.17,24.7 119.89,24.7 v120.71,23.88
  Bottom 0.203: v55.18,90.74 55.44,90.49 55.44,37.72 68.96,24.19 86.49,24.19 v87.19,23.5 | v122.17,25.34 v120.71,23.88
PREL1  (via drill 0.4)
  Top 0.203: 90.74,89.79 90.74,90.55 v90.49,90.81 | Q2.1 90.74,89.79 | 90.74,89.79 R3.1 | IC1.40 124.37,21.69 124.65,21.97 124.65,22.61 122.68,24.57 121.79,24.57 120.78,25.59 97.28,25.59 95.31,27.56 91.95,27.56 91.69,27.3 v90.81,27.3
  Bottom 0.203: v90.49,90.81 91,90.3 91,27.5 v90.81,27.3
PREL2  (via drill 0.4)
  Top 0.203: Q3.1 126.3,89.79 | 126.3,89.79 R4.1 | 126.3,89.79 126.05,90.05 v126.05,90.74 | IC1.41 v123.89,22.29
  Bottom 0.203: v126.05,90.74 126.56,90.23 126.56,27.62 123.89,24.96 v123.89,22.29
PREL3
  Top 0.203: IC1.42 123.38,21.78 123.13,22.04 123.13,23.43 122.49,24.07 121.6,24.07 120.52,25.15 97.92,25.15 96.59,23.82 R5.1 94.8,23.69 Q4.1
PREL4  (via drill 0.4)
  Top 0.203: IC1.43 122.87,21.65 122.21,22.31 v122.21,22.92 | Q5.1 R6.1 123.38,54.99 v124.71,53.66
  Top 0.406: R6.1
  Bottom 0.203: v122.21,22.92 123,23.71 123,25.34 125.54,27.88 125.54,52.83 v124.71,53.66
PREL5  (via drill 0.4)
  Top 0.203: Q6.1 126.3,54.61 | 126.3,54.61 R7.1 | 126.3,54.61 125.79,55.12 v125.79,55.5 | IC1.45 v121.88,21.57 121.86,21.59
  Bottom 0.203: v125.79,55.5 126.05,55.24 126.05,27.75 123.44,25.15 123.44,22.92 122.08,21.57 v121.88,21.57
SWCLK
  Top 0.203: IC1.37 129.13,20.34 130.49,18.99 X1.2
SWDIO
  Top 0.203: IC1.34 128.74,17.88 X1.4
UART_RX  (via drill 0.4)
  Top 0.203: IC1.31 125.6,16.38 125.09,16.89 v124.59,16.89
  Bottom 0.203: v124.59,16.89 124.21,16.89 120.71,13.4 104.33,13.4 103.82,13.91 101.73,13.91 100.65,12.83 90.61,12.83 89.92,12.13 87.91,12.13 X2.28
UART_TX  (via drill 0.4)
  Top 0.203: RN2.1 104.22,13.16 104.2,13.14 v103.44,13.14 103.44,14.41 v102.74,15.11 | v101.6,18.29 IC2.2 | IC1.30 v125.09,15.88
  Bottom 0.203: v102.74,15.11 101.73,16.13 101.73,18.16 v101.6,18.29 | v103.44,13.14 103.63,12.95 120.9,12.95 123.83,15.88 v125.09,15.88

### Text on the board
tPlace: 2 SWCLK / 3 Gnd / 4 SWDIO | EEZ DIB PREL6 / (09/2020 r1B3)
bPlace: EEZ DIB PREL6 (09/2020 r1B3) / Project source code: github.com/eez-open | EEZ DIB